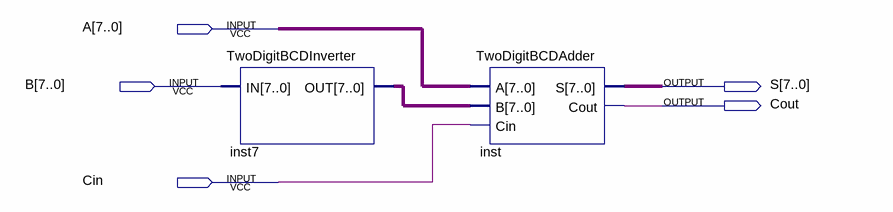
[diagram p0: schematic sheet]
// Quartus schematic TwoDigitBCDSubtractor.bdf as structural Verilog: 2 symbols, 5 pins
module TwoDigitBCDSubtractor (
  input  [7:0] A,
  input  [7:0] B,
  input  Cin,
  output [7:0] S,
  output Cout
);

  wire [7:0] inst7_out;

  TwoDigitBCDInverter inst7 (.IN(B), .OUT(inst7_out));
  TwoDigitBCDAdder inst (.A(A), .B(inst7_out), .Cin(Cin), .S(S), .Cout(Cout));
endmodule
